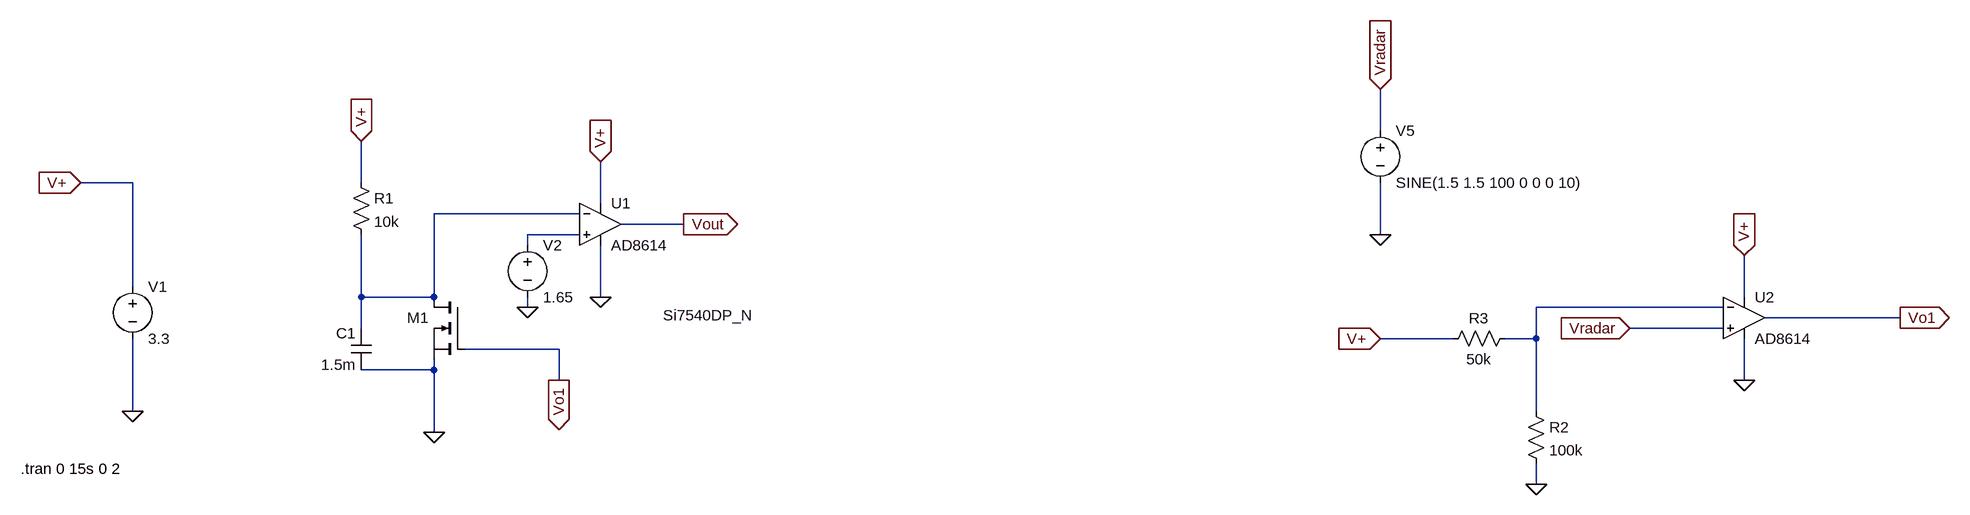
[diagram p0: schematic MonostableVibrator.asc]
MonostableVibrator.asc, the LTspice schematic file:
Version 4
SHEET 1 2568 680
WIRE 1664 -192 1664 -256
WIRE -256 -112 -336 -112
WIRE 96 -112 96 -176
WIRE 464 -80 464 -144
WIRE 432 -64 208 -64
WIRE 592 -48 496 -48
WIRE 432 -32 352 -32
WIRE 1664 -32 1664 -112
WIRE 352 -16 352 -32
WIRE -256 48 -256 -112
WIRE 96 64 96 -32
WIRE 208 64 208 -64
WIRE 208 64 96 64
WIRE 464 64 464 -16
WIRE 2224 64 2224 0
WIRE 352 80 352 64
WIRE 2192 80 1904 80
WIRE 2464 96 2256 96
WIRE 96 112 96 64
WIRE 2192 112 2048 112
WIRE 1776 128 1664 128
WIRE 1904 128 1904 80
WIRE 1904 128 1856 128
WIRE 400 144 256 144
WIRE 208 176 208 160
WIRE 208 176 96 176
WIRE 400 192 400 144
WIRE 2224 192 2224 128
WIRE -256 240 -256 128
WIRE 1904 240 1904 128
WIRE 208 272 208 176
WIRE 1904 352 1904 320
FLAG 464 64 0
FLAG -256 240 0
FLAG -336 -112 V+
IOPIN -336 -112 In
FLAG 208 272 0
FLAG 96 -176 V+
IOPIN 96 -176 In
FLAG 352 80 0
FLAG 464 -144 V+
IOPIN 464 -144 In
FLAG 592 -48 Vout
IOPIN 592 -48 Out
FLAG 2224 0 V+
IOPIN 2224 0 In
FLAG 2224 192 0
FLAG 1904 352 0
FLAG 1664 128 V+
IOPIN 1664 128 In
FLAG 1664 -32 0
FLAG 1664 -256 Vradar
IOPIN 1664 -256 In
FLAG 2048 112 Vradar
IOPIN 2048 112 In
FLAG 2464 96 Vo1
IOPIN 2464 96 Out
FLAG 400 192 Vo1
IOPIN 400 192 Out
SYMBOL nmos 256 64 M0
WINDOW 3 -443 28 Left 2
SYMATTR InstName M1
SYMATTR Value Si7540DP_N
SYMBOL Opamps\\AD8614 464 -112 R0
SYMATTR InstName U1
SYMBOL voltage -256 32 R0
WINDOW 123 0 0 Left 0
WINDOW 39 0 0 Left 0
SYMATTR InstName V1
SYMATTR Value 3.3
SYMBOL res 80 -128 R0
SYMATTR InstName R1
SYMATTR Value 10k
SYMBOL cap 112 176 R180
WINDOW 0 24 56 Left 2
WINDOW 3 24 8 Left 2
SYMATTR InstName C1
SYMATTR Value 1.5m
SYMBOL voltage 352 -32 R0
WINDOW 123 0 0 Left 0
WINDOW 39 0 0 Left 0
SYMATTR InstName V2
SYMATTR Value 1.65
SYMBOL Opamps\\AD8614 2224 32 R0
SYMATTR InstName U2
SYMBOL res 1888 224 R0
SYMATTR InstName R2
SYMATTR Value 100k
SYMBOL res 1872 112 R90
WINDOW 0 0 56 VBottom 2
WINDOW 3 32 56 VTop 2
SYMATTR InstName R3
SYMATTR Value 50k
SYMBOL voltage 1664 -208 R0
WINDOW 123 0 0 Left 0
WINDOW 39 0 0 Left 0
SYMATTR InstName V5
SYMATTR Value SINE(1.5 1.5 100 0 0 0 10)
TEXT -428 328 Left 2 !.tran 0 15s 0 2

The netlist it stands for:
* MonostableVibrator.asc
M1 N001 Vo1 0 0 Si7540DP_N
XU1 N002 N001 V+ 0 Vout AD8614  ; pins In+ In- V+ V- OUT
V1 V+ 0 3.3
R1 V+ N001 10k
C1 0 N001 1.5m
V2 N002 0 1.65
XU2 Vradar N003 V+ 0 Vo1 AD8614  ; pins In+ In- V+ V- OUT
R2 N003 0 100k
R3 N003 V+ 50k
V5 Vradar 0 SINE(1.5 1.5 100 0 0 0 10)
.model NMOS NMOS
.model PMOS PMOS
.lib standard.mos
.tran 0 15s 0 2
.backanno
.end